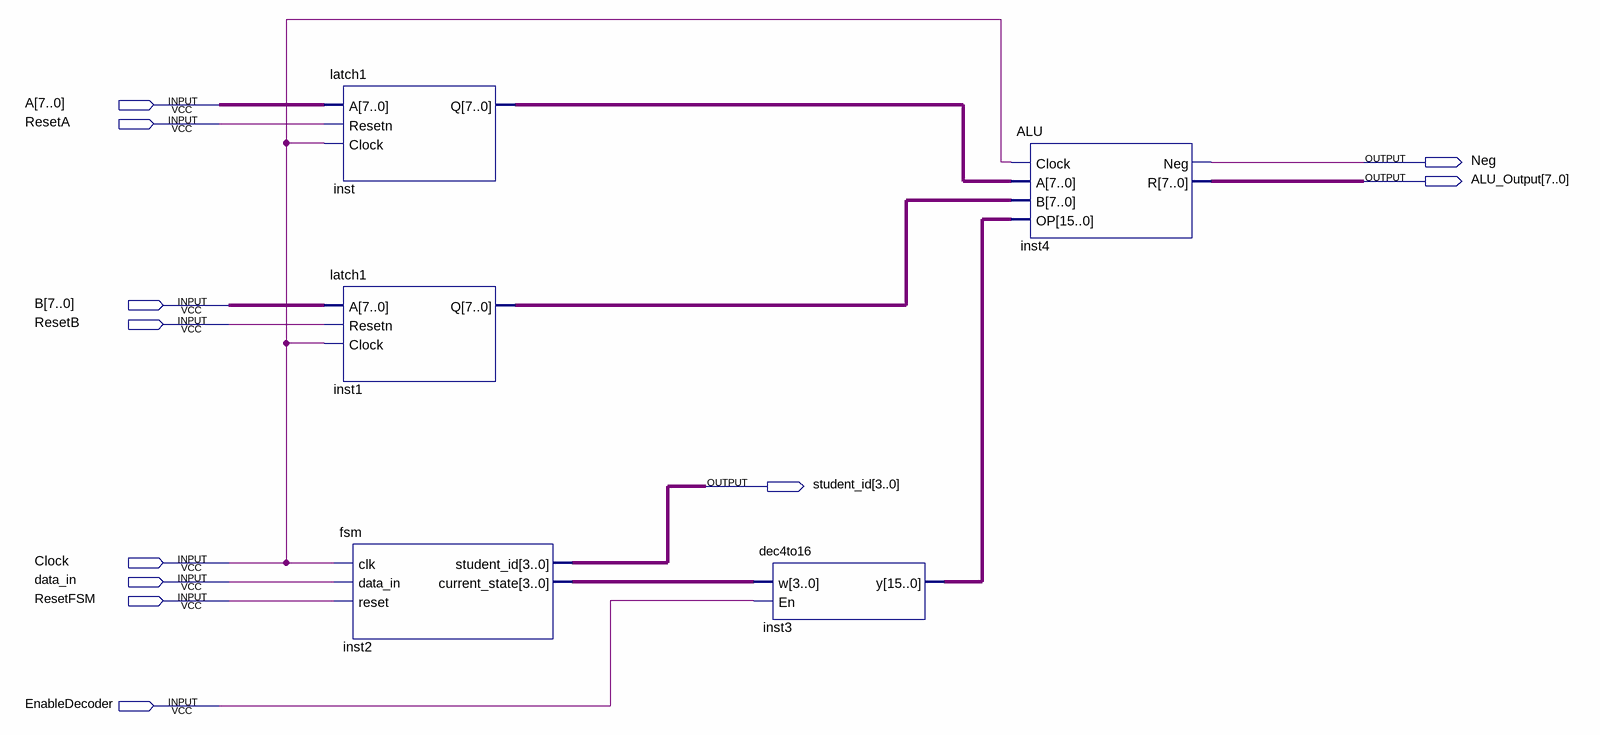
[diagram p0: schematic sheet]
// Quartus schematic finalDesign2.bdf as structural Verilog: 5 symbols, 11 pins
module finalDesign2 (
  input  [7:0] A,
  input  ResetA,
  input  [7:0] B,
  input  ResetB,
  input  Clock,
  input  data_in,
  input  ResetFSM,
  input  EnableDecoder,
  output Neg,
  output [7:0] ALU_Output,
  output [3:0] student_id
);

  wire [3:0] inst2_current_state;
  wire [7:0] inst1_q, inst_q;
  wire [15:0] inst3_y;

  latch1 inst (.A(A), .Resetn(ResetA), .Clock(Clock), .Q(inst_q));
  latch1 inst1 (.A(B), .Resetn(ResetB), .Clock(Clock), .Q(inst1_q));
  fsm inst2 (
    .clk(Clock), .data_in(data_in), .reset(ResetFSM), .student_id(student_id),
    .current_state(inst2_current_state));
  dec4to16 inst3 (.w(inst2_current_state), .En(EnableDecoder), .y(inst3_y));
  ALU inst4 (.Clock(Clock), .A(inst_q), .B(inst1_q), .OP(inst3_y), .Neg(Neg), .R(ALU_Output));
endmodule
